# Altium schematic sheet Counter.SchDoc
size A4
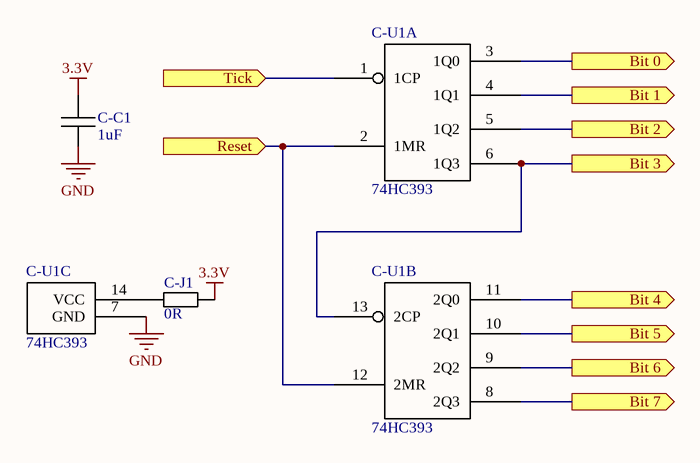
[diagram p0: Counter.SchDoc]

## Parts
C-C1  1uF  [C 0805 / 2012]
C-J1  0R  [R 0805 / 2012 wide]
C-U1  74HC393  [SOIC-14]  (parts A,B,C of 3)

## Ports
Bit 0 (out), Bit 1 (out), Bit 2 (out), Bit 3 (out), Bit 4 (out), Bit 5 (out), Bit 6 (out), Bit 7 (out), Reset (in), Tick (in)

## Nets
3.3V: C-C1.1 C-J1.2
GND: C-C1.2 C-U1.7(GND)
Bit 0: C-U1.3(1Q0) ; port Bit 0
Bit 1: C-U1.4(1Q1) ; port Bit 1
Bit 2: C-U1.5(1Q2) ; port Bit 2
Bit 3: C-U1.6(1Q3) C-U1.13(2CP) ; port Bit 3
Bit 4: C-U1.11(2Q0) ; port Bit 4
Bit 5: C-U1.10(2Q1) ; port Bit 5
Bit 6: C-U1.9(2Q2) ; port Bit 6
Bit 7: C-U1.8(2Q3) ; port Bit 7
Reset: C-U1.2(1MR) C-U1.12(2MR) ; port Reset
Tick: C-U1.1(1CP) ; port Tick
NetC-J1_1: C-J1.1 C-U1.14(VCC)

## Library data of the parts
C-C1 = Capacitor
C-J1 = Resistor
C-U1 = 74HC393: Dual 4-Bit Counter